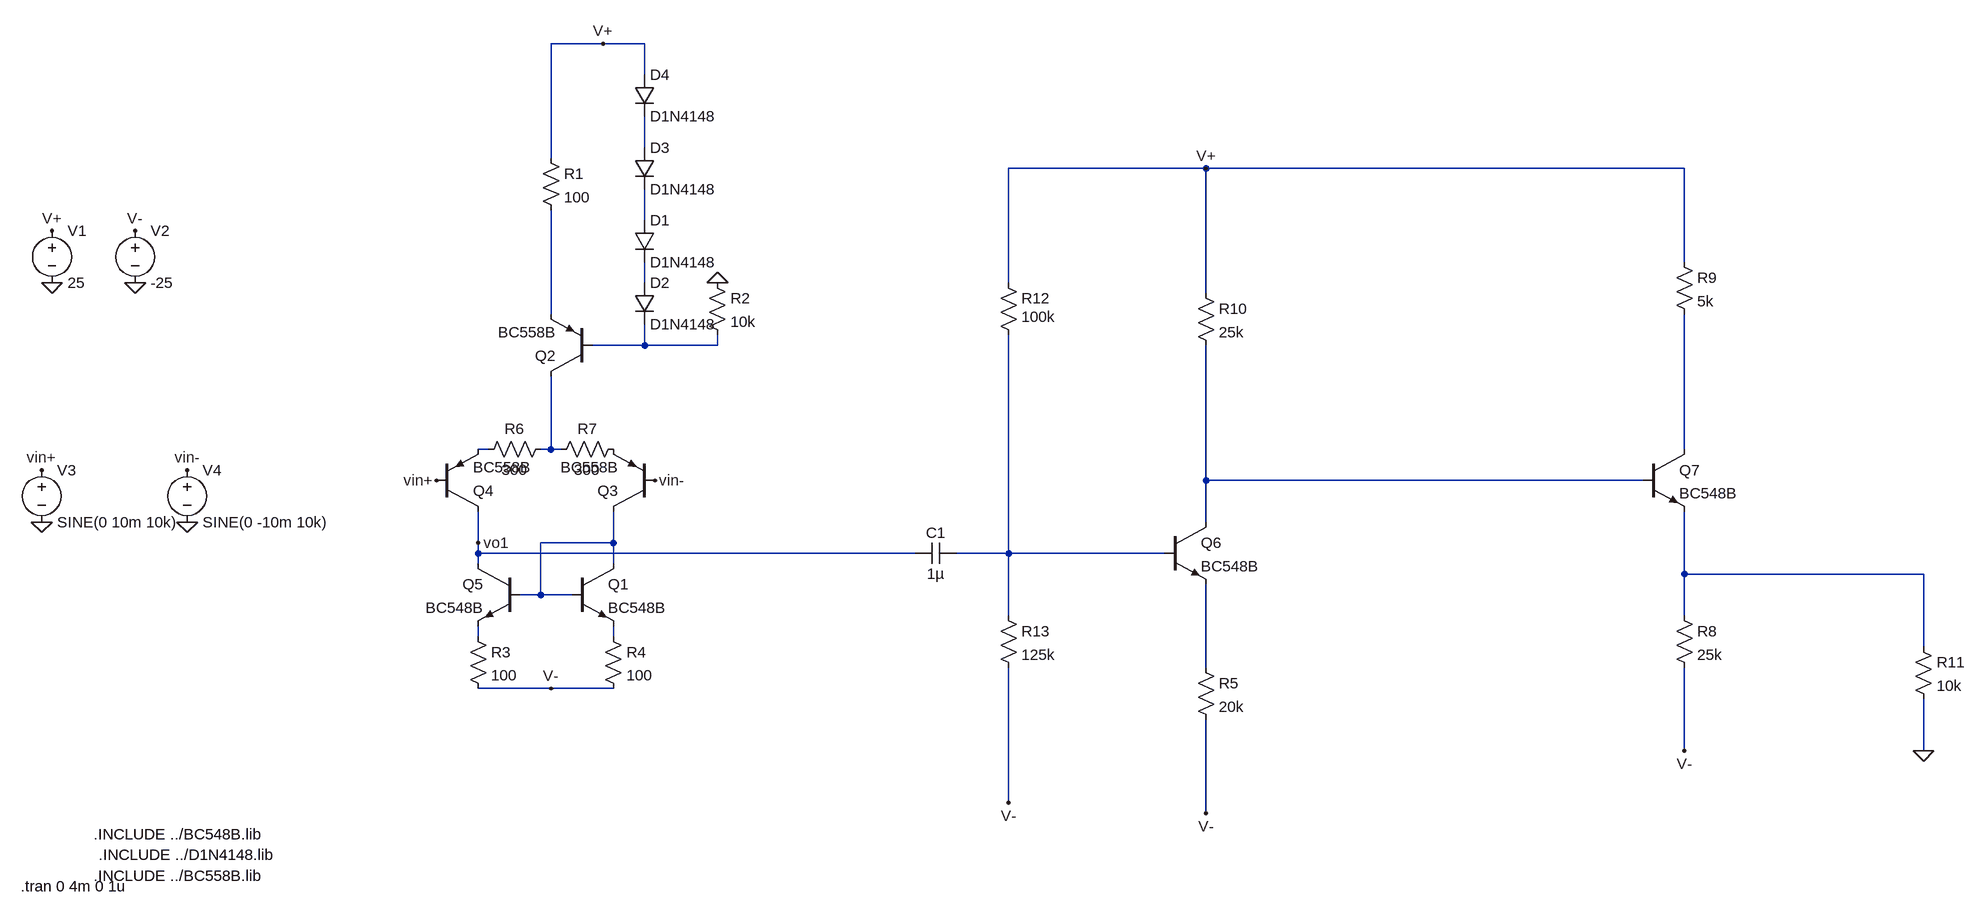
[diagram p0: schematic total.asc]
total.asc, the LTspice schematic file:
Version 4
SHEET 1 4564 1376
WIRE 2464 -1504 2384 -1504
WIRE 2528 -1504 2464 -1504
WIRE 2528 -1456 2528 -1504
WIRE 2528 -1344 2528 -1392
WIRE 2384 -1328 2384 -1504
WIRE 3392 -1312 3088 -1312
WIRE 4128 -1312 3392 -1312
WIRE 2528 -1232 2528 -1280
WIRE 4128 -1168 4128 -1312
WIRE 2528 -1136 2528 -1168
WIRE 3088 -1136 3088 -1312
WIRE 3392 -1120 3392 -1312
WIRE 2384 -1088 2384 -1248
WIRE 2528 -1040 2528 -1072
WIRE 2528 -1040 2448 -1040
WIRE 2640 -1040 2640 -1056
WIRE 2640 -1040 2528 -1040
WIRE 2288 -880 2272 -880
WIRE 2384 -880 2384 -992
WIRE 2384 -880 2368 -880
WIRE 2400 -880 2384 -880
WIRE 4128 -880 4128 -1088
WIRE 3392 -832 3392 -1040
WIRE 4064 -832 3392 -832
WIRE 3392 -768 3392 -832
WIRE 2272 -736 2272 -784
WIRE 2480 -736 2480 -784
WIRE 2480 -736 2368 -736
WIRE 2272 -720 2272 -736
WIRE 2944 -720 2272 -720
WIRE 3088 -720 3088 -1056
WIRE 3088 -720 3008 -720
WIRE 3328 -720 3088 -720
WIRE 2272 -704 2272 -720
WIRE 2480 -704 2480 -736
WIRE 4128 -688 4128 -784
WIRE 4496 -688 4128 -688
WIRE 2368 -656 2368 -736
WIRE 2368 -656 2336 -656
WIRE 2416 -656 2368 -656
WIRE 3088 -624 3088 -720
WIRE 4128 -624 4128 -688
WIRE 2272 -592 2272 -608
WIRE 2480 -592 2480 -608
WIRE 4496 -576 4496 -688
WIRE 3392 -544 3392 -672
WIRE 2384 -512 2272 -512
WIRE 2480 -512 2384 -512
WIRE 4128 -416 4128 -544
WIRE 4496 -416 4496 -496
WIRE 3088 -336 3088 -544
WIRE 3392 -320 3392 -464
FLAG 1616 -1216 V+
FLAG 2384 -512 V-
FLAG 1744 -1216 V-
FLAG 2208 -832 vin+
FLAG 1600 -848 vin+
FLAG 2544 -832 vin-
FLAG 2272 -736 vo1
FLAG 1744 -1136 0
FLAG 1616 -1136 0
FLAG 1824 -848 vin-
FLAG 1600 -768 0
FLAG 1824 -768 0
FLAG 4496 -416 0
FLAG 3392 -1312 V+
FLAG 3392 -320 V-
FLAG 2640 -1136 0
FLAG 2464 -1504 V+
FLAG 3088 -336 V-
FLAG 4128 -416 V-
SYMBOL npn 2416 -704 R0
SYMATTR InstName Q1
SYMATTR Value BC548B
SYMBOL pnp 2544 -784 R180
SYMATTR InstName Q3
SYMATTR Value BC558B
SYMBOL pnp 2208 -784 M180
SYMATTR InstName Q4
SYMATTR Value BC558B
SYMBOL npn 2336 -704 M0
SYMATTR InstName Q5
SYMATTR Value BC548B
SYMBOL res 2256 -608 R0
SYMATTR InstName R3
SYMATTR Value 100
SYMBOL res 2464 -608 R0
SYMATTR InstName R4
SYMATTR Value 100
SYMBOL voltage 1616 -1232 R0
WINDOW 123 0 0 Left 2
WINDOW 39 0 0 Left 2
SYMATTR InstName V1
SYMATTR Value 25
SYMBOL voltage 1744 -1232 R0
WINDOW 123 0 0 Left 2
WINDOW 39 0 0 Left 2
SYMATTR InstName V2
SYMATTR Value -25
SYMBOL voltage 1600 -864 R0
WINDOW 123 0 0 Left 2
WINDOW 39 0 0 Left 2
SYMATTR InstName V3
SYMATTR Value SINE(0 10m 10k)
SYMBOL voltage 1824 -864 R0
WINDOW 123 0 0 Left 2
WINDOW 39 0 0 Left 2
SYMATTR InstName V4
SYMATTR Value SINE(0 -10m 10k)
SYMBOL res 2384 -896 R90
WINDOW 0 0 56 VBottom 2
WINDOW 3 32 56 VTop 2
SYMATTR InstName R6
SYMATTR Value 300
SYMBOL res 2496 -896 R90
WINDOW 0 0 56 VBottom 2
WINDOW 3 32 56 VTop 2
SYMATTR InstName R7
SYMATTR Value 300
SYMBOL npn 3328 -768 R0
SYMATTR InstName Q6
SYMATTR Value BC548B
SYMBOL cap 3008 -736 R90
WINDOW 0 0 32 VBottom 2
WINDOW 3 32 32 VTop 2
SYMATTR InstName C1
SYMATTR Value 1µ
SYMBOL npn 4064 -880 R0
SYMATTR InstName Q7
SYMATTR Value BC548B
SYMBOL res 3376 -560 R0
SYMATTR InstName R5
SYMATTR Value 20k
SYMBOL res 4112 -640 R0
SYMATTR InstName R8
SYMATTR Value 25k
SYMBOL res 4112 -1184 R0
SYMATTR InstName R9
SYMATTR Value 5k
SYMBOL res 3376 -1136 R0
SYMATTR InstName R10
SYMATTR Value 25k
SYMBOL res 4480 -592 R0
SYMATTR InstName R11
SYMATTR Value 10k
SYMBOL res 3072 -1152 R0
WINDOW 3 36 68 Left 2
SYMATTR Value 100k
SYMATTR InstName R12
SYMBOL res 2368 -1344 R0
SYMATTR InstName R1
SYMATTR Value 100
SYMBOL res 2624 -1152 R0
SYMATTR InstName R2
SYMATTR Value 10k
SYMBOL pnp 2448 -992 R180
SYMATTR InstName Q2
SYMATTR Value BC558B
SYMBOL diode 2512 -1232 R0
SYMATTR InstName D1
SYMATTR Value D1N4148
SYMBOL diode 2512 -1136 R0
SYMATTR InstName D2
SYMATTR Value D1N4148
SYMBOL diode 2512 -1344 R0
SYMATTR InstName D3
SYMATTR Value D1N4148
SYMBOL diode 2512 -1456 R0
SYMATTR InstName D4
SYMATTR Value D1N4148
SYMBOL res 3072 -640 R0
SYMATTR InstName R13
SYMATTR Value 125k
TEXT 1680 -288 Left 2 !.INCLUDE ../BC548B.lib
TEXT 1688 -256 Left 2 !.INCLUDE ../D1N4148.lib
TEXT 1680 -224 Left 2 !.INCLUDE ../BC558B.lib
TEXT 1568 -208 Left 2 !.tran 0 4m 0 1u

The netlist it stands for:
* total.asc
Q1 N010 N010 N014 0 BC548B
Q3 N010 vin- P001 0 BC558B
Q4 vo1 vin+ N006 0 BC558B
Q5 vo1 N010 N013 0 BC548B
R3 N013 V- 100
R4 N014 V- 100
V1 V+ 0 25
V2 V- 0 -25
V3 vin+ 0 SINE(0 10m 10k)
V4 vin- 0 SINE(0 -10m 10k)
R6 N007 N006 300
R7 P001 N007 300
Q6 N009 N011 N015 0 BC548B
C1 N011 vo1 1µ
Q7 N008 N009 N012 0 BC548B
R5 N015 V- 20k
R8 N012 V- 25k
R9 V+ N008 5k
R10 V+ N009 25k
R11 N012 0 10k
R12 V+ N011 100k
R1 V+ N004 100
R2 0 N005 10k
Q2 N007 N005 N004 0 BC558B
D1 N002 N003 D1N4148
D2 N003 N005 D1N4148
D3 N001 N002 D1N4148
D4 V+ N001 D1N4148
R13 N011 V- 125k
.model D D
.lib standard.dio
.model NPN NPN
.model PNP PNP
.lib standard.bjt
.INCLUDE ../BC548B.lib
.INCLUDE ../D1N4148.lib
.INCLUDE ../BC558B.lib
.tran 0 4m 0 1u
.backanno
.end